# EAGLE design SCFschem (EAGLE 8.7.1)
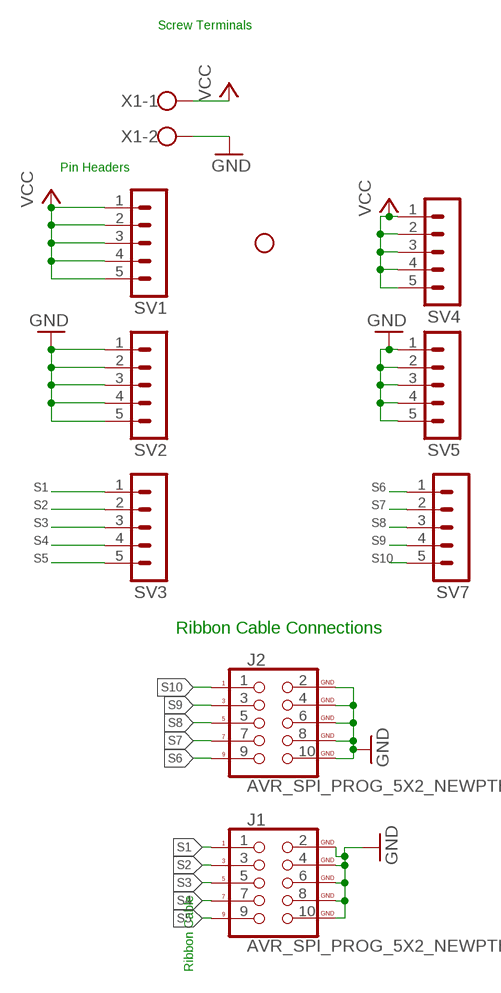
[diagram p0: schematic, sheet 1]

## Parts
H1  STAND-OFF  [STAND-OFF]
J1  AVR_SPI_PROG_5X2_NEWPTH2  [2X5-SHROUDED]
J2  AVR_SPI_PROG_5X2_NEWPTH2  [2X5-SHROUDED]
SV1  MA05-1  [MA05-1]
SV2  MA05-1  [MA05-1]
SV3  MA05-1  [MA05-1]
SV4  MA05-1  [MA05-1]
SV5  MA05-1  [MA05-1]
SV7  MA05-1  [MA05-1]
X1  1X02_5MM_SCREW  [W237-102]

## Nets
GND: J1.2(GND) J1.4(GND) J1.6(GND) J1.8(GND) J1.10(GND) J2.2(GND) J2.4(GND) J2.6(GND) J2.8(GND) J2.10(GND) SV2.1 SV2.2 SV2.3 SV2.4 SV2.5 SV5.1 SV5.2 SV5.3 SV5.4 SV5.5 X1.2
S1: J1.1 SV3.1
S2: J1.3 SV3.2
S3: J1.5 SV3.3
S4: J1.7 SV3.4
S5: J1.9 SV3.5
S6: J2.9 SV7.1
S7: J2.7 SV7.2
S8: J2.5 SV7.3
S9: J2.3 SV7.4
S10: J2.1 SV7.5
VCC: SV1.1 SV1.2 SV1.3 SV1.4 SV1.5 SV4.1 SV4.2 SV4.3 SV4.4 SV4.5 X1.1

## Notes on the sheet
- Screw Terminals
- Pin Headers
- Ribbon Cable Connections
- Ribbon Cable

## Library data of the parts
H1 = SparkFun-Hardware:STAND-OFF: Stand Off Drill holes for mechanically mounting via screws, standoffs, etc. Note: Use the keepout ring to avoid running the screw head into surrounding components. Variant Overviews STAND-OFF - Mechanical footprint for a #4 phillips button head screw. STAND-OFF-TIGHT - Mechanical footprint for a #4 phillips button head screw, Example SparkFun Products Screw - Phillips Head (1/4", 4-40, 10 pack) <https://www.sparkfun.com/products/10453> (PRT-10453) Screw - Phillips Head (1/2", 4-40, 10 pack) <https://www.sparkfun.com/products/10452> (PRT-10452) Screw - Phillips Head (3/4", 4-40, 10 pack) <https://www.sparkfun.com/products/10451> (PRT-10451) Screw - Phillips Head (1", 4-40, 10 pack) <https://www.sparkfun.com/products/10450> (PRT-10450)
J1 J2 = SparkFun-Connectors:AVR_SPI_PROG_5X2_NEW: AVR 10-pin ICSP Header This is the standard AVR In Circuit Serial Programming header. Minimal, but includes pin one indicator. Works with standard Olimex programmers. SparkFun Products: 2x5 AVR ICSP Male Header <https://www.sparkfun.com/products/778> - PTH 2x5 Pin Shrouded Header <https://www.sparkfun.com/products/8506> - PTH2; PROD_ID: CONN-08671; SF_ID: PRT-08506
SV1-SV5 SV7 = con-lstb:MA05-1: PIN HEADER; OC_FARNELL: unknown; OC_NEWARK: unknown
X1 = ECE388:1X02_5MM_SCREW: WAGO SCREW CLAMP; MPN: 237-102; OC_FARNELL: unknown; OC_NEWARK: 70K9898

## Board
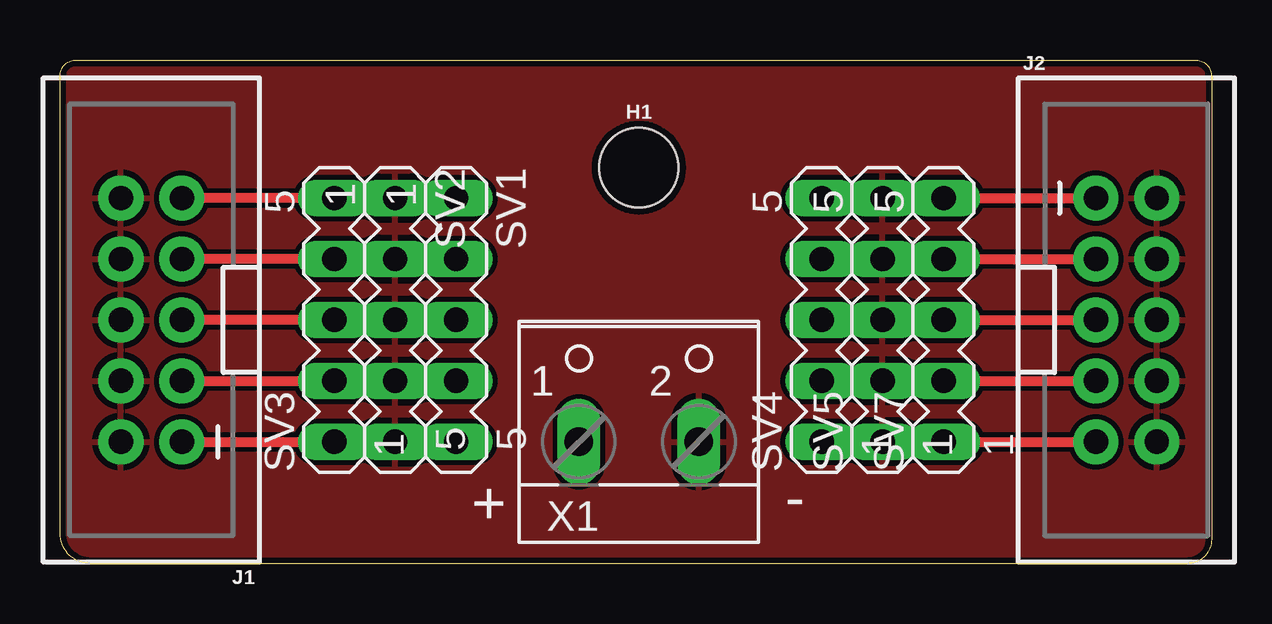
[diagram p1: board, top side]
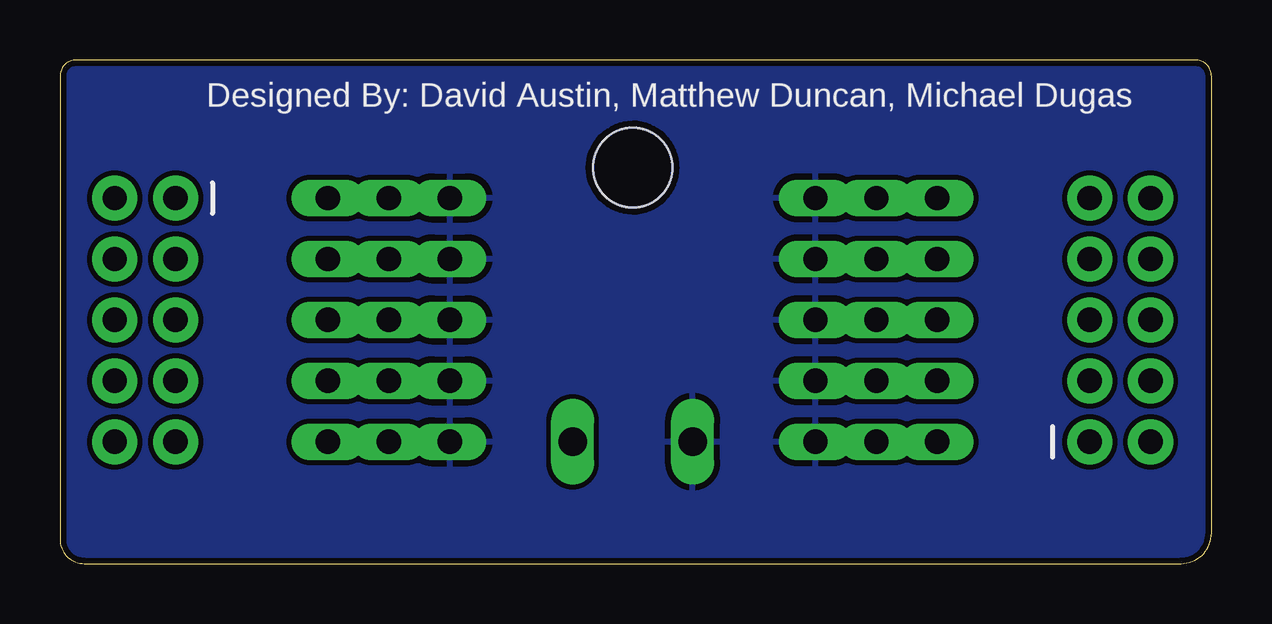
[diagram p2: board, bottom side, seen from below]

Size 48 x 21 mm. Coordinates in mm from the lower left corner, seen from the top.
Outline: 0.68,21 47.32,21 arc-90 48,20.32 48,1.01 arc-90 46.99,0 1.27,0 arc-90 0,1.27 0,20.32 arc-90 0.68,21
Copper layers (1*16): Top 0.035mm / dielectric 1.5mm / Bottom 0.035mm
Design rules "Dirty8TS *": minimum track width 8mil, minimum drill 15mil, track to track 8mil, track to pad 8mil, pad to pad 8mil, via to via 8mil, smd to smd 0mil, copper to edge 10mil, drill to drill 10mil, minimum pad ring 10mil, minimum via ring 6mil, stop-mask expansion 2mil, vias tented up to drill 25mil, thermal gap 10mil

### Footprints (pad centres in the part's own frame; a part is rotated, then mirrored left to right if it is on the bottom)
STAND-OFF = hole 3.302: 0,0
2X5-SHROUDED = drill 1.016 pad 1.88: 1 -1.27,5.08; 2 1.27,5.08; 3 -1.27,2.54; 4 1.27,2.54; 5 -1.27,0; 6 1.27,0; 7 -1.27,-2.54; 8 1.27,-2.54; 9 -1.27,-5.08; 10 1.27,-5.08
MA05-1 = drill 1.016 long: 1 -5.08,0; 2 -2.54,0; 3 0,0; 4 2.54,0; 5 5.08,0
W237-102 = drill 1.194 long: 1 -2.5,-1.27; 2 2.5,-1.27

### Placement (x,y rotation side)
H1  24.13,16.51 0 top
J1  3.81,10.16 180 top
J2  44.45,10.16 0 top
SV1  16.51,10.16 270 top
SV2  13.97,10.16 270 top
SV3  11.43,10.16 90 top
SV4  31.75,10.16 90 top
SV5  34.29,10.16 90 top
SV7  36.83,10.16 90 top
X1  24.13,6.35 0 top

### Tracks (layer width: path | path; a pad name or v marks a point on that pad's centre or on a via)
GND
  pour Top: 0,21 48,21 48.26,0 0,0
S1
  Top 0.406: J1.1 SV3.1
S2
  Top 0.406: J1.3 SV3.2
S3
  Top 0.406: SV3.3 J1.5
S4
  Top 0.406: SV3.4 J1.7
S5
  Top 0.406: SV3.5 J1.9
S6
  Top 0.406: SV7.1 J2.9
S7
  Top 0.406: SV7.2 J2.7
S8
  Top 0.406: SV7.3 J2.5
S9
  Top 0.406: SV7.4 J2.3
S10
  Top 0.406: SV7.5 J2.1
VCC
  pour Bottom: 0,0 0,21 48,21 48.26,0

### Text on the board
tPlace: + | -
bPlace: Designed By: David Austin, Matthew Duncan, Michael Dugas